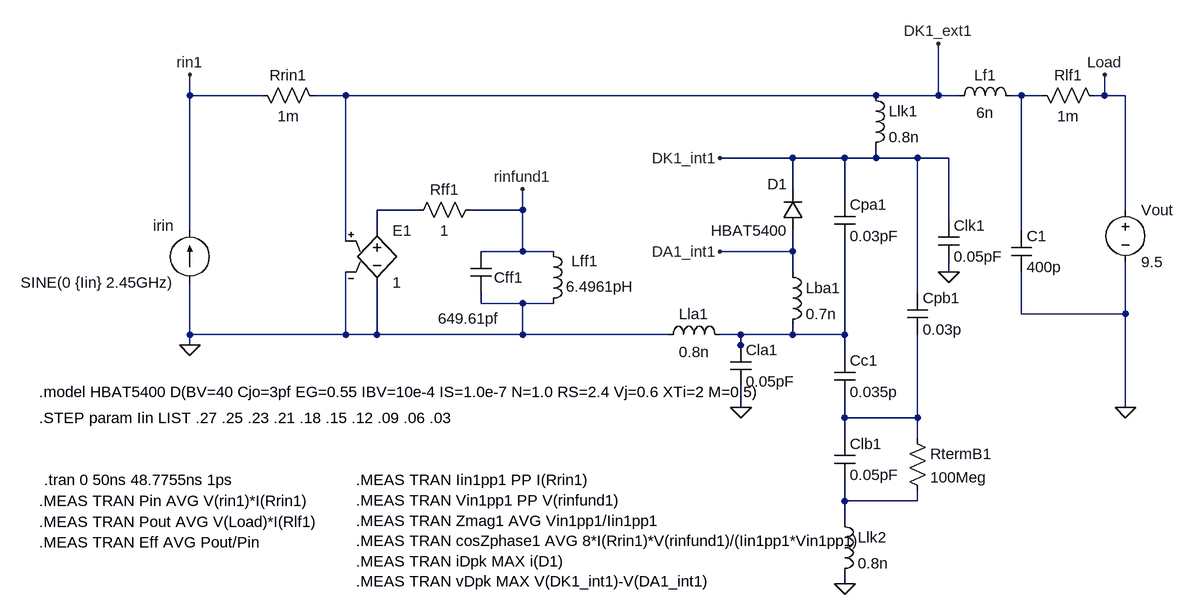
[diagram p0: schematic no-parasitics.asc]
no-parasitics.asc, the LTspice schematic file:
Version 4
SHEET 1 2084 796
WIRE 112 -256 112 -288
WIRE 224 -256 112 -256
WIRE 352 -256 304 -256
WIRE 1168 -256 352 -256
WIRE 1264 -256 1264 -336
WIRE 1264 -256 1168 -256
WIRE 1296 -256 1264 -256
WIRE 1392 -256 1376 -256
WIRE 1424 -256 1392 -256
WIRE 1520 -256 1520 -288
WIRE 1520 -256 1504 -256
WIRE 1552 -256 1520 -256
WIRE 1040 -160 928 -160
WIRE 1120 -160 1040 -160
WIRE 1168 -160 1168 -176
WIRE 1168 -160 1120 -160
WIRE 1232 -160 1168 -160
WIRE 1280 -160 1232 -160
WIRE 1040 -112 1040 -160
WIRE 1120 -96 1120 -160
WIRE 464 -80 400 -80
WIRE 624 -80 624 -112
WIRE 624 -80 544 -80
WIRE 1552 -80 1552 -256
WIRE 1280 -64 1280 -160
WIRE 112 -48 112 -256
WIRE 400 -48 400 -80
WIRE 1392 -48 1392 -256
WIRE 352 -32 352 -256
WIRE 624 -16 624 -80
WIRE 624 -16 560 -16
WIRE 672 -16 624 -16
WIRE 1040 -16 1040 -48
WIRE 1040 -16 928 -16
WIRE 1040 16 1040 -16
WIRE 1280 16 1280 0
WIRE 1232 48 1232 -160
WIRE 560 64 560 48
WIRE 624 64 560 64
WIRE 672 64 624 64
WIRE 1392 80 1392 16
WIRE 1552 80 1552 0
WIRE 1552 80 1392 80
WIRE 112 112 112 32
WIRE 352 112 352 16
WIRE 352 112 112 112
WIRE 400 112 400 32
WIRE 400 112 352 112
WIRE 624 112 624 64
WIRE 624 112 400 112
WIRE 848 112 624 112
WIRE 960 112 928 112
WIRE 1040 112 1040 96
WIRE 1040 112 960 112
WIRE 1120 112 1120 -32
WIRE 1120 112 1040 112
WIRE 112 128 112 112
WIRE 960 128 960 112
WIRE 960 144 960 128
WIRE 1120 144 1120 112
WIRE 960 224 960 192
WIRE 1552 224 1552 80
WIRE 1120 240 1120 208
WIRE 1232 240 1232 112
WIRE 1232 240 1120 240
WIRE 1120 272 1120 240
WIRE 1232 272 1232 240
WIRE 1120 368 1120 336
WIRE 1232 368 1232 352
WIRE 1232 368 1120 368
WIRE 1120 400 1120 368
WIRE 1120 496 1120 480
FLAG 112 128 0
FLAG 928 -160 DK1_int1
FLAG 112 -288 rin1
FLAG 1520 -288 Load
FLAG 624 -112 rinfund1
FLAG 1280 16 0
FLAG 960 224 0
FLAG 1120 496 0
FLAG 928 -16 DA1_int1
FLAG 1264 -336 DK1_ext1
FLAG 1552 224 0
SYMBOL cap 1104 -96 R0
SYMATTR InstName Cpa1
SYMATTR Value 0.03pF
SYMBOL cap 1264 -64 R0
SYMATTR InstName Clk1
SYMATTR Value 0.05pF
SYMBOL ind 1280 -240 R270
WINDOW 0 32 56 VTop 2
WINDOW 3 5 56 VBottom 2
SYMATTR InstName Lf1
SYMATTR Value 6n
SYMBOL res 1408 -272 M90
WINDOW 0 0 56 VBottom 2
WINDOW 3 32 56 VTop 2
SYMATTR InstName Rlf1
SYMATTR Value 1m
SYMBOL cap 544 -16 R0
WINDOW 0 36 40 Left 2
WINDOW 3 -50 103 Left 2
SYMATTR InstName Cff1
SYMATTR Value 649.61pf
SYMBOL ind 656 -32 R0
WINDOW 0 43 31 Left 2
WINDOW 3 35 70 Left 2
SYMATTR InstName Lff1
SYMATTR Value 6.4961pH
SYMBOL e 400 -64 R0
SYMATTR InstName E1
SYMATTR Value 1
SYMBOL current 112 32 R180
WINDOW 0 24 88 Left 2
WINDOW 3 24 0 Left 2
WINDOW 123 0 0 Left 2
WINDOW 39 0 0 Left 2
SYMATTR InstName irin
SYMATTR Value SINE(0 {Iin} 2.45GHz)
SYMBOL res 560 -96 R90
WINDOW 0 0 56 VBottom 2
WINDOW 3 32 56 VTop 2
SYMATTR InstName Rff1
SYMATTR Value 1
SYMBOL voltage 1552 -96 R0
WINDOW 123 0 0 Left 2
WINDOW 39 0 0 Left 2
SYMATTR InstName Vout
SYMATTR Value 9.5
SYMBOL res 208 -272 M90
WINDOW 0 0 56 VBottom 2
WINDOW 3 32 56 VTop 2
SYMATTR InstName Rrin1
SYMATTR Value 1m
SYMBOL diode 1056 -48 R180
WINDOW 0 24 72 Left 2
WINDOW 3 24 0 Left 2
SYMATTR InstName D1
SYMATTR Value HBAT5400
SYMBOL ind 1024 0 R0
SYMATTR InstName Lba1
SYMATTR Value 0.7n
SYMBOL ind 1152 -272 R0
SYMATTR InstName Llk1
SYMATTR Value 0.8n
SYMBOL cap 944 128 R0
SYMATTR InstName Cla1
SYMATTR Value 0.05pF
SYMBOL cap 1104 144 R0
SYMATTR InstName Cc1
SYMATTR Value 0.035p
SYMBOL cap 1104 272 R0
SYMATTR InstName Clb1
SYMATTR Value 0.05pF
SYMBOL cap 1216 48 R0
SYMATTR InstName Cpb1
SYMATTR Value 0.03p
SYMBOL ind 832 128 R270
WINDOW 0 32 56 VTop 2
WINDOW 3 5 56 VBottom 2
SYMATTR InstName Lla1
SYMATTR Value 0.8n
SYMBOL res 1216 256 R0
SYMATTR InstName RtermB1
SYMATTR Value 100Meg
SYMBOL ind 1104 384 R0
SYMATTR InstName Llk2
SYMATTR Value 0.8n
SYMBOL cap 1376 -48 R0
SYMATTR InstName C1
SYMATTR Value 400p
TEXT -120 200 Left 2 !.model HBAT5400 D(BV=40 Cjo=3pf EG=0.55 IBV=10e-4 IS=1.0e-7 N=1.0 RS=2.4 Vj=0.6 XTi=2 M=0.5)
TEXT -112 336 Left 2 !.tran 0 50ns 48.7755ns 1ps
TEXT -120 368 Left 2 !.MEAS TRAN Pin AVG V(rin1)*I(Rrin1)
TEXT -120 400 Left 2 !.MEAS TRAN Pout AVG V(Load)*I(Rlf1)
TEXT -120 432 Left 2 !.MEAS TRAN Eff AVG Pout/Pin
TEXT 368 336 Left 2 !.MEAS TRAN Iin1pp1 PP I(Rrin1)\n.MEAS TRAN Vin1pp1 PP V(rinfund1)\n.MEAS TRAN Zmag1 AVG Vin1pp1/Iin1pp1\n.MEAS TRAN cosZphase1 AVG 8*I(Rrin1)*V(rinfund1)/(Iin1pp1*Vin1pp1)\n.MEAS TRAN iDpk MAX i(D1)\n.MEAS TRAN vDpk MAX V(DK1_int1)-V(DA1_int1)
TEXT -120 240 Left 2 !.STEP param Iin LIST .27 .25 .23 .21 .18 .15 .12 .09 .06 .03

The netlist it stands for:
* no-parasitics.asc
Cpa1 DK1_int1 N003 0.03pF
Clk1 DK1_int1 0 0.05pF
Lf1 DK1_ext1 N001 6n
Rlf1 N001 Load 1m
Cff1 rinfund1 0 649.61pf
Lff1 rinfund1 0 6.4961pH
E1 N002 0 DK1_ext1 0 1
irin 0 rin1 SINE(0 {Iin} 2.45GHz)
Rff1 rinfund1 N002 1
Vout Load 0 9.5
Rrin1 rin1 DK1_ext1 1m
D1 DA1_int1 DK1_int1 HBAT5400
Lba1 DA1_int1 N003 0.7n
Llk1 DK1_ext1 DK1_int1 0.8n
Cla1 N003 0 0.05pF
Cc1 N003 N004 0.035p
Clb1 N004 N005 0.05pF
Cpb1 DK1_int1 N004 0.03p
Lla1 0 N003 0.8n
RtermB1 N004 N005 100Meg
Llk2 N005 0 0.8n
C1 N001 0 400p
.model D D
.lib standard.dio
.model HBAT5400 D(BV=40 Cjo=3pf EG=0.55 IBV=10e-4 IS=1.0e-7 N=1.0 RS=2.4 Vj=0.6 XTi=2 M=0.5)
.tran 0 50ns 48.7755ns 1ps
.MEAS TRAN Pin AVG V(rin1)*I(Rrin1)
.MEAS TRAN Pout AVG V(Load)*I(Rlf1)
.MEAS TRAN Eff AVG Pout/Pin
.MEAS TRAN Iin1pp1 PP I(Rrin1)
.MEAS TRAN Vin1pp1 PP V(rinfund1)
.MEAS TRAN Zmag1 AVG Vin1pp1/Iin1pp1
.MEAS TRAN cosZphase1 AVG 8*I(Rrin1)*V(rinfund1)/(Iin1pp1*Vin1pp1)
.MEAS TRAN iDpk MAX i(D1)
.MEAS TRAN vDpk MAX V(DK1_int1)-V(DA1_int1)
.STEP param Iin LIST .27 .25 .23 .21 .18 .15 .12 .09 .06 .03
.backanno
.end